# Altium schematic sheet W5500.SchDoc
size A4
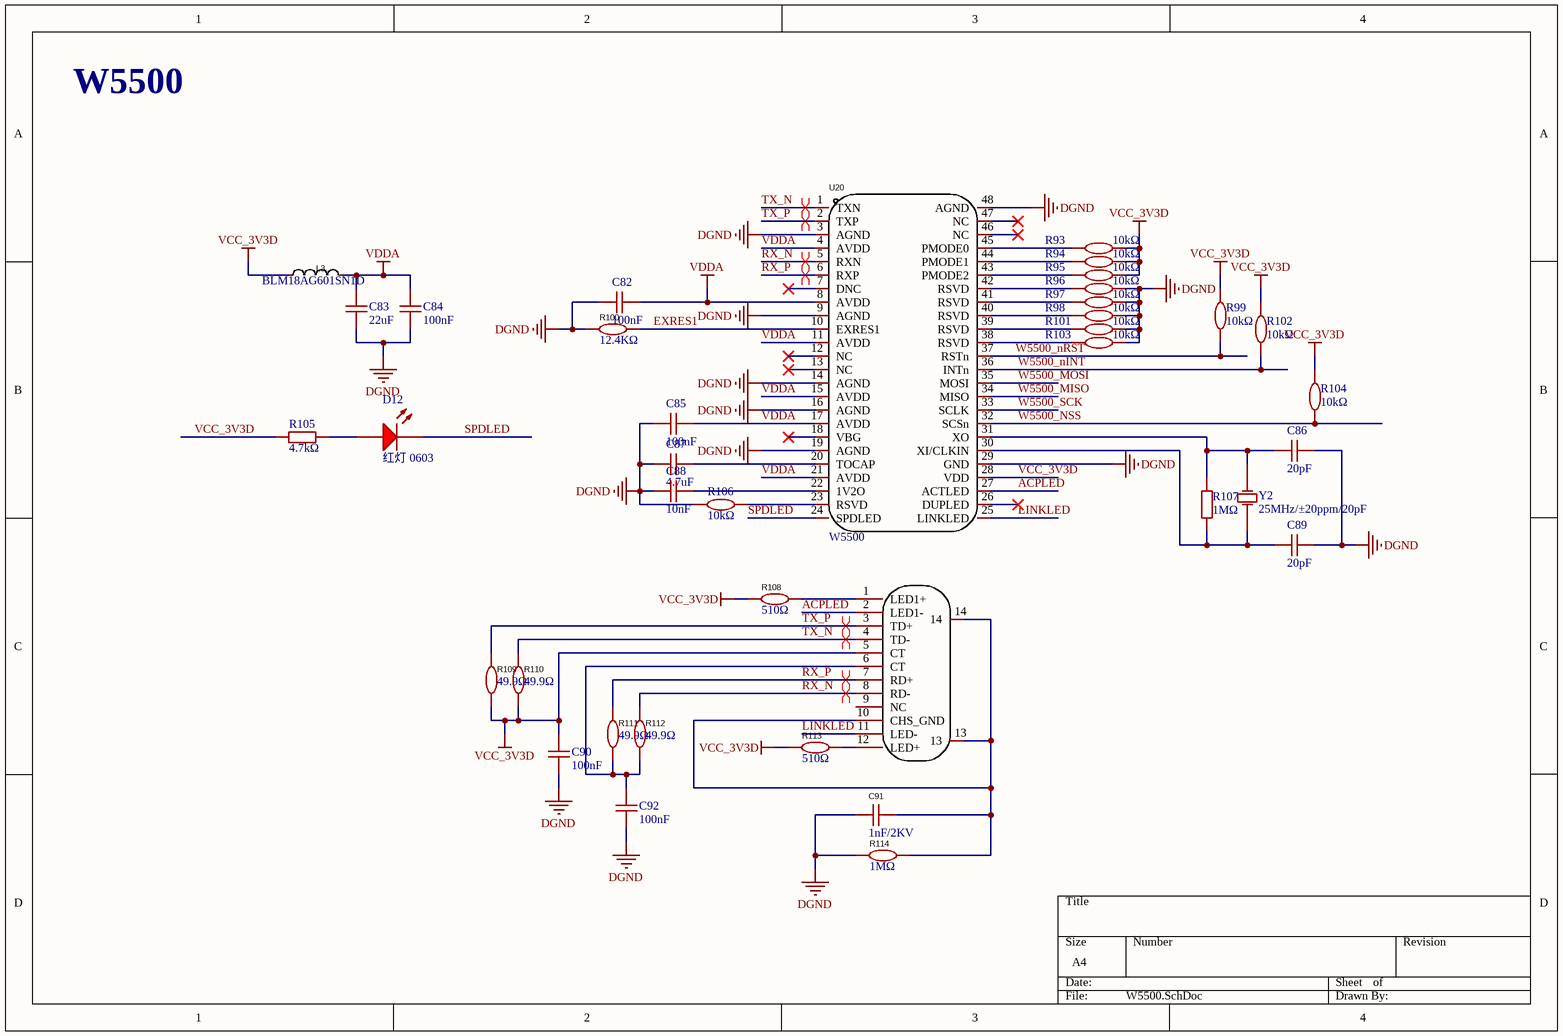
[diagram p0: W5500.SchDoc]

## Parts
C82  100nF  [C0402]
C83  22uF  [C0603]
C84  100nF  [C0402]
C85  100nF  [C0402]
C86  20pF  [C0603]
C87  4.7uF  [C0402]
C88  10nF  [C0402]
C89  20pF  [C0603]
C90  100nF  [C0402]
C91  1nF/2KV  [C1206]
C92  100nF  [C0402]
D12  红灯 0603  [LED_0603]
L3  BLM18AG601SN1D  [L0603]
R93  10kΩ  [R0402]
R94  10kΩ  [R0402]
R95  10kΩ  [R0402]
R96  10kΩ  [R0402]
R97  10kΩ  [R0402]
R98  10kΩ  [R0402]
R99  10kΩ  [R0402]
R100  12.4KΩ  [R0402]
R101  10kΩ  [R0402]
R102  10kΩ  [R0402]
R103  10kΩ  [R0402]
R104  10kΩ  [R0402]
R105  4.7kΩ  [R0603]
R106  10kΩ  [R0402]
R107  1MΩ  [R0603]
R108  510Ω  [R0402]
R109  49.9Ω  [R0402]
R110  49.9Ω  [R0402]
R111  49.9Ω  [R0402]
R112  49.9Ω  [R0402]
R113  510Ω  [R0402]
R114  1MΩ  [R0402]
RJ1  HR961160C  [RJ45-SMD_HR961160C]  (value not drawn)
U20  W5500  [LQFP-48_L7.0-W7.0-P0.50-LS9.0-BL]
Y2  25MHz/±20ppm/20pF  [SMD-5032_2P]

## Nets
DGND: C82.1 C83.1 C84.1 C85.1 C86.2 C87.1 C88.1 C89.2 C90.1 C91.1 C92.1 R96.1 R97.1 R98.1 R100.1 R101.1 R103.1 R106.2 R114.1 U20.3(AGND) U20.9(AGND) U20.14(AGND) U20.16(AGND) U20.19(AGND) U20.29(GND) U20.48(AGND)
VCC_3V3D: C90.2 L3.1 R93.1 R94.1 R95.1 R99.1 R102.1 R104.1 R105.2 R108.2 R109.1 R110.1 R113.2 RJ1.5(CT) U20.28(VDD)
VDDA: C82.2 C83.2 C84.2 C85.2 L3.2 U20.4(AVDD) U20.8(AVDD) U20.11(AVDD) U20.15(AVDD) U20.17(AVDD) U20.21(AVDD)
ACPLED: RJ1.2(LED1-) U20.27(ACTLED)
EXRES1: R100.2 U20.10(EXRES1)
LINKLED: RJ1.11(LED-) U20.25(LINKLED)
RX_N: R112.2 RJ1.8(RD-) U20.5(RXN)
RX_P: R111.2 RJ1.7(RD+) U20.6(RXP)
SPDLED: D12.K U20.24(SPDLED)
TX_N: R110.2 RJ1.4(TD-) U20.1(TXN)
TX_P: R109.2 RJ1.3(TD+) U20.2(TXP)
W5500_MISO: U20.34(MISO)
W5500_MOSI: U20.35(MOSI)
W5500_nINT: R102.2 U20.36(INTn)
W5500_nRST: R99.2 U20.37(RSTn)
W5500_NSS: R104.2 U20.32(SCSn)
W5500_SCK: U20.33(SCLK)
NetC86_1: C86.1 R107.2 U20.31(XO) Y2.2(OSC2)
NetC87_2: C87.2 U20.20(TOCAP)
NetC88_2: C88.2 U20.22(1V2O)
NetC89_1: C89.1 R107.1 U20.30(XI/CLKIN) Y2.1(OSC1)
NetC91_2: C91.2 R114.2 RJ1.10(CHS_GND) RJ1.13 RJ1.14
NetC92_2: C92.2 R111.1 R112.1 RJ1.6(CT)
NetD12_A: D12.A R105.1
NetR93_2: R93.2 U20.45(PMODE0)
NetR94_2: R94.2 U20.44(PMODE1)
NetR95_2: R95.2 U20.43(PMODE2)
NetR96_2: R96.2 U20.42(RSVD)
NetR97_2: R97.2 U20.41(RSVD)
NetR98_2: R98.2 U20.40(RSVD)
NetR101_2: R101.2 U20.39(RSVD)
NetR103_2: R103.2 U20.38(RSVD)
NetR106_1: R106.1 U20.23(RSVD)
NetR108_1: R108.1 RJ1.1(LED1+)
NetR113_1: R113.1 RJ1.12(LED+)

Not connected (* = marked no-connect by the designer): RJ1 9(NC); U20 7(DNC)* 12(NC)* 13(NC)* 18(VBG)* 26(DUPLED)* 46(NC)* 47(NC)*

## Layout directives
differential pair: RX_N, RX_P, TX_N, TX_P

## Notes on the sheet
- W5500

## Library data of the parts
C82 C84 C85 C90 C92 = 100nF/50V,C0402: 贴片电容,X7R; ComponentLink1Description: 供应商链接; ComponentLink1URL: http://www.szlcsc.com/product/details_16531.html
C83 = 22uF/50V,C0603: 贴片电容,X7R; ComponentLink1Description: 供应商链接; ComponentLink1URL: http://www.szlcsc.com/product/details_16531.html
C86 C89 = 20pF/50V,C0603: 贴片电容,X7R; ComponentLink1Description: 供应商链接; ComponentLink1URL: http://www.szlcsc.com/product/details_16531.html
C87 = 4.7uF/50V,C0402: 贴片电容,X7R; ComponentLink1Description: 供应商链接; ComponentLink1URL: http://www.szlcsc.com/product/details_16531.html
C88 = 10nF/50V,C0402: 贴片电容,X7R; ComponentLink1Description: 供应商链接; ComponentLink1URL: http://www.szlcsc.com/product/details_16531.html
C91 = 1nF/2KV,C1206: 贴片电容,X7R
D12 = 红灯 0603: 发光二极管; ComponentLink1Description: 供应商链接; ComponentLink1URL: http://www.szlcsc.com/product/details_2659.html
L3 = BLM18AG601SN1D: Manufacturer: muRata(村田); Add into BOM: yes; Impedance @ Frequency: 600Ω@100MHz; Tolerance: ±25%; DC Resistance: 380mΩ; Current Rating: 500mA; Circuits: 1; Name: BLM18AG601SN1D; Symbol: BLM18AG601SN1D; Device: BLM18AG601SN1D; LCSC Part Name: 单路 0603磁珠 阻抗600Ω@100MHz; Supplier Part: C19330; Manufacturer Part: BLM18AG601SN1D; Supplier Footprint: 0603; JLCPCB Part Class: Extended Part; Datasheet: https://atta.szlcsc.com/upload/public/pdf/source/20180326/C19330_93F4AC33FF94C8E22511353688ADC0FA.pdf; Supplier: LCSC; Convert to PCB: yes
R93-R99 R101-R104 R106 = 10kΩ,R0402: 电阻类型:厚膜电阻;阻值:10kΩ;精度:±1%;功率:100mW;最大工作电压:75V;温度系数:±100ppm/℃;
R100 = 12.4KΩ,R0402: 贴片电阻12.4KΩ;1%
R105 = 4.7kΩ,R0603: 贴片电阻; ComponentLink1Description: 供应商链接; ComponentLink1URL: http://www.szlcsc.com/product/details_21904.html
R107 = 1MΩ,R0603: 贴片电阻; ComponentLink1Description: 供应商链接; ComponentLink1URL: http://www.szlcsc.com/product/details_23662.html
R108 R113 = 510Ω,R0402: 贴片电阻
R109-R112 = 49.9Ω,R0402: 贴片电阻49.9R;1%
R114 = 1MΩ,R0402: 电阻类型:厚膜电阻;阻值:1MΩ;精度:±1%;功率:100mW;最大工作电压:75V;温度系数:±100ppm/℃;
Y2 = 25MHz/±20ppm/20pF,SMD5032: X503225MSB2GI;无源晶振; ComponentLink1Description: 供应商链接; ComponentLink1URL: http://www.szlcsc.com/product/details_117214.html